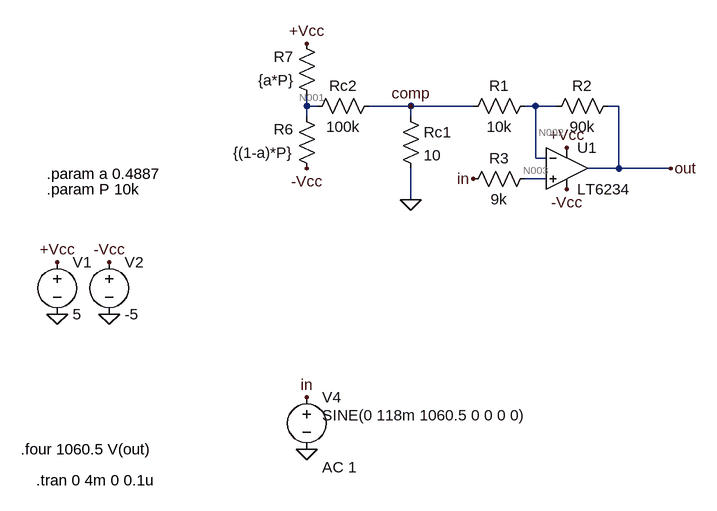
[diagram p0: schematic amp-neinv-comp-DC.asc]
* amp-neinv-comp-DC.asc
* U1: LT6234 (symbol OpAmps\LT6234 not available, pins judged from their places): In+=N003 In-=N002 V+=+Vcc V-=-Vcc OUT=out
V1 +Vcc 0 5
V2 -Vcc 0 -5
R3 N003 in 9k
R2 out N002 90k
R1 N002 comp 10k
Rc1 comp 0 10
Rc2 comp N001 100k
R6 -Vcc N001 {(1-a)*P}
R7 N001 +Vcc {a*P}
V4 in 0 SINE(0 118m 1060.5 0 0 0 0) AC 1
.param P 10k
.param a 0.4887
.tran 0 4m 0 0.1u
.four 1060.5 V(out)
.backanno
.end

* Results of the author's LTspice run, read from the files saved beside the schematic
* Operating Point, zero values left out:
*   V(out) = 11.09 µV
*   V(-vcc) = -5 V
*   V(+vcc) = 5 V
*   V(n003) = -13.49 mV
*   V(n002) = -13.5 mV
*   V(comp) = -2.468 µV
*   V(n001) = 110.2 mV
*   I(R3) = -1.499 µA
*   I(R2) = 150.1 nA
*   I(R1) = -1.349 µA
*   I(Rc1) = -246.8 nA
*   I(Rc2) = -1.102 µA
*   I(R6) = -999.5 µA
*   I(R7) = -1.001 mA
*   I(V1) = -2.041 mA
*   I(V2) = 2.043 mA
*   I(V4) = -1.499 µA
*   Ix(u1:1) = 1.499 µA
*   Ix(u1:2) = 1.499 µA
*   Ix(u1:3) = -150.1 nA
*   Ix(u1:4) = 1.04 mA
*   Ix(u1:5) = -1.043 mA
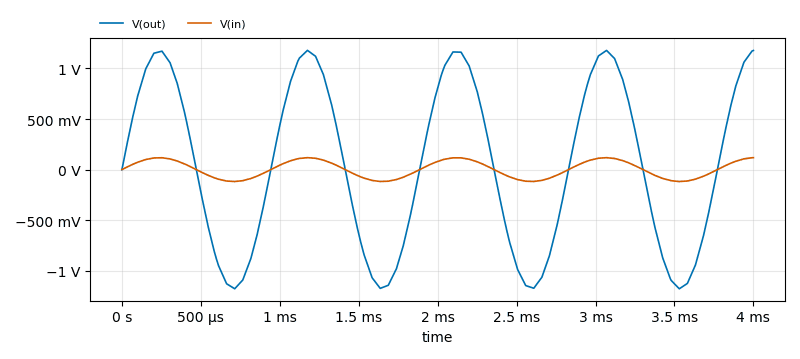
[diagram p1: Transient Analysis of amp-neinv-comp-DC.asc, plotted from the saved traces]
* Transient Analysis, 1 run:
*   V(out): min -1.178 V, max 1.179 V, average 41.81 mV, rms 829.2 mV, last 1.177 V
*   V(in): min -117.9 mV, max 118 mV, average 4.185 mV, rms 83 mV, last 117.9 mV
* From the log:
*   N-Period=1
*   Fourier components of V(out)
*   DC component:2.20087e-06
*   Harmonic  Frequency   Fourier   Normalized   Phase    Normalized
*    Number     [Hz]     Component   Component  [degree]  Phase [deg]
*       1      1.060e+3   1.179e+0   1.000e+0     90.02°      0.00°
*       2      2.121e+3   3.518e-5   2.985e-5    166.42°     76.40°
*       3      3.182e+3   3.808e-4   3.230e-4     91.61°      1.59°
*       4      4.242e+3   9.017e-5   7.649e-5    170.41°     80.40°
*       5      5.302e+3   4.124e-5   3.499e-5   -126.79°   -216.81°
*       6      6.363e+3   4.379e-4   3.715e-4    -24.73°   -114.75°
*       7      7.424e+3   2.098e-4   1.780e-4   -106.60°   -196.62°
*       8      8.484e+3   3.567e-4   3.026e-4    153.95°     63.93°
*       9      9.544e+3   1.458e-4   1.237e-4     59.84°    -30.18°
*   Partial Harmonic Distortion: 0.062353%
*   Total Harmonic Distortion:   0.089229%